# Altium project Carte Oeil.PrjPCB
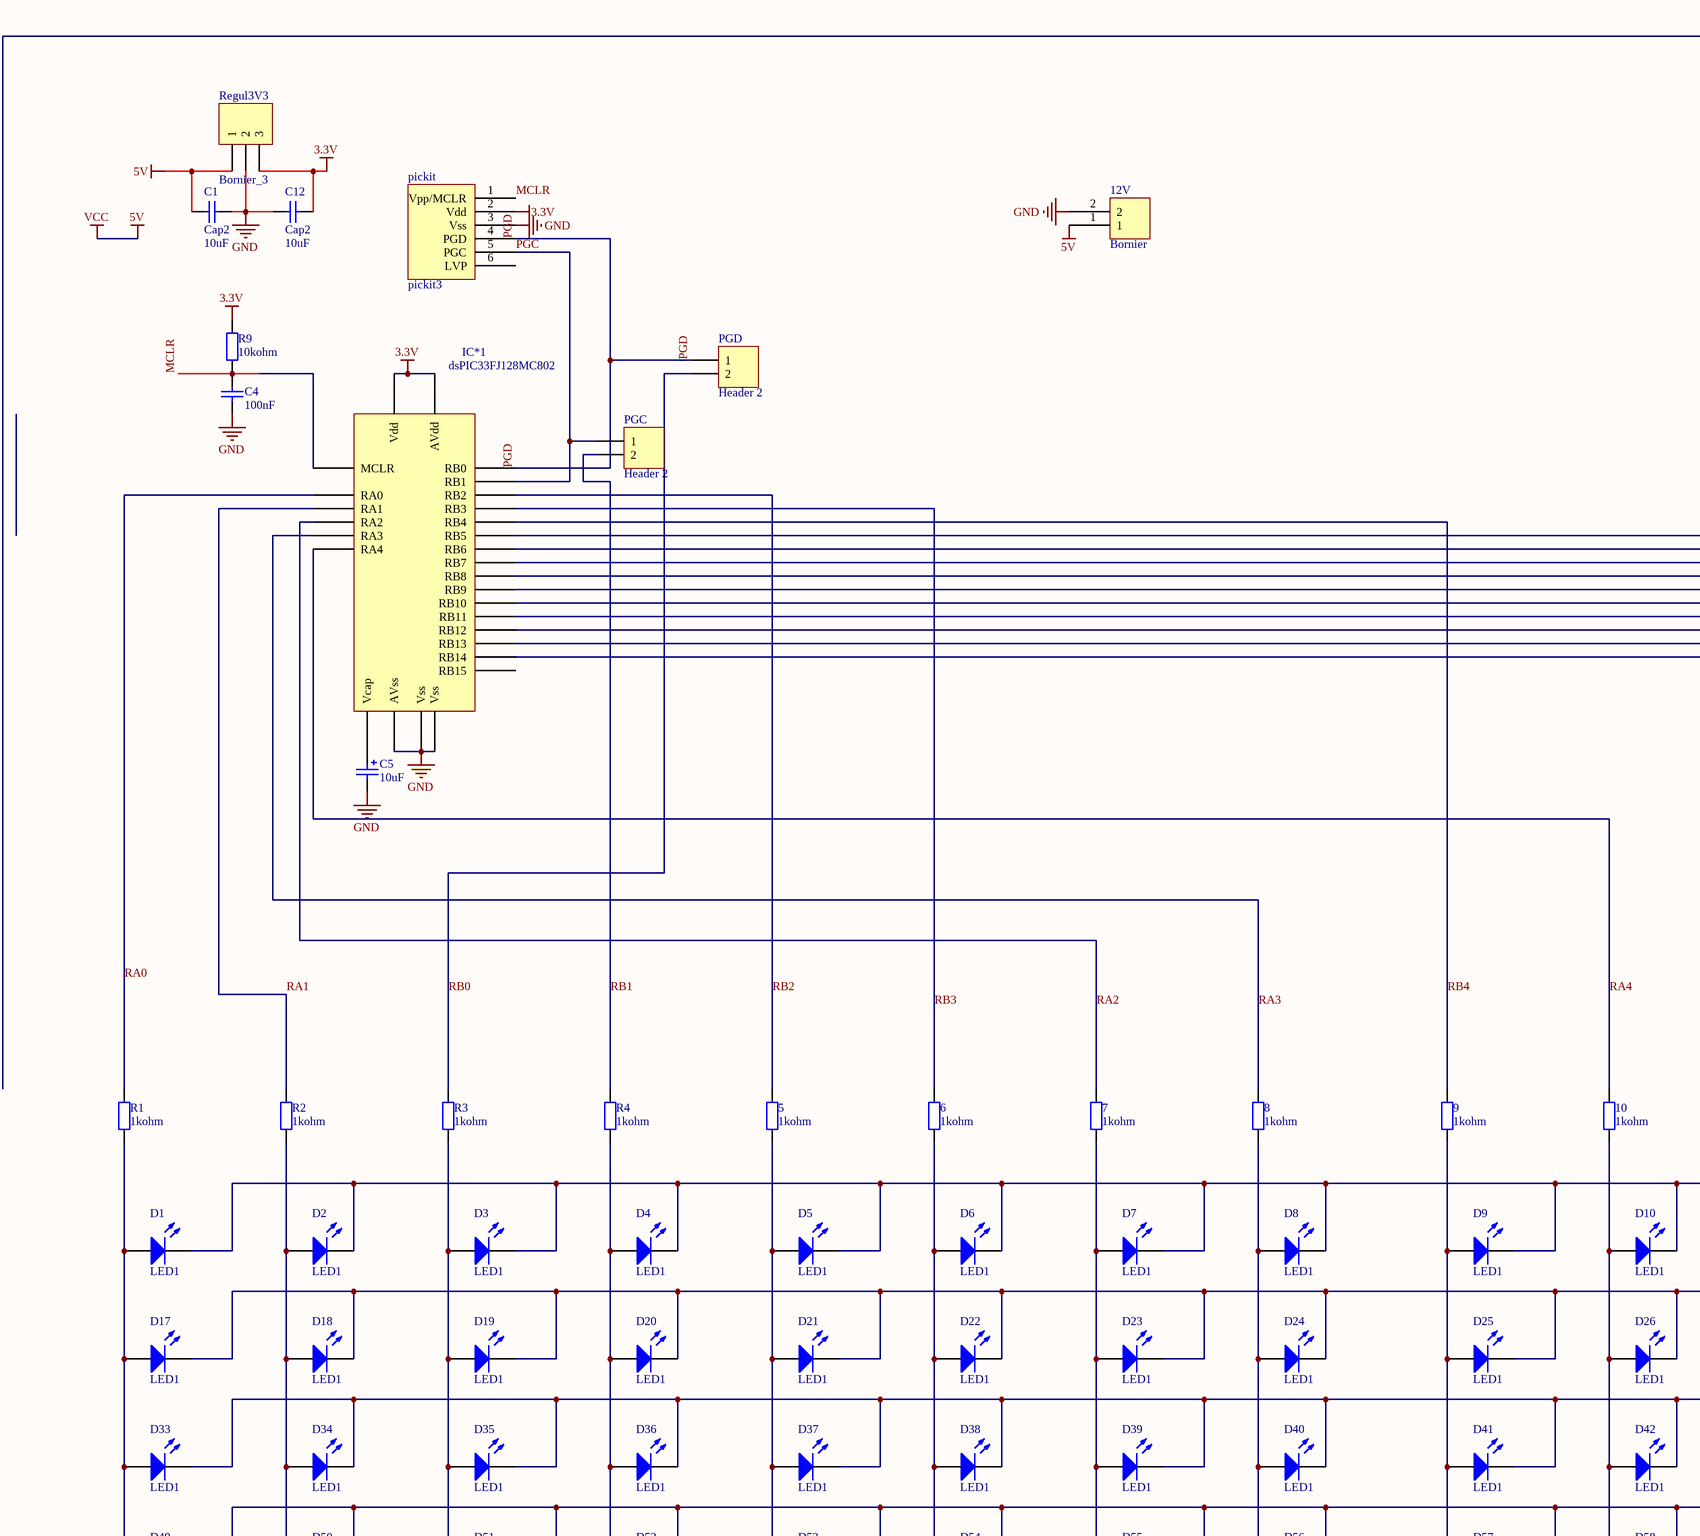
[diagram p0: Carte Oeil.SchDoc, top left]
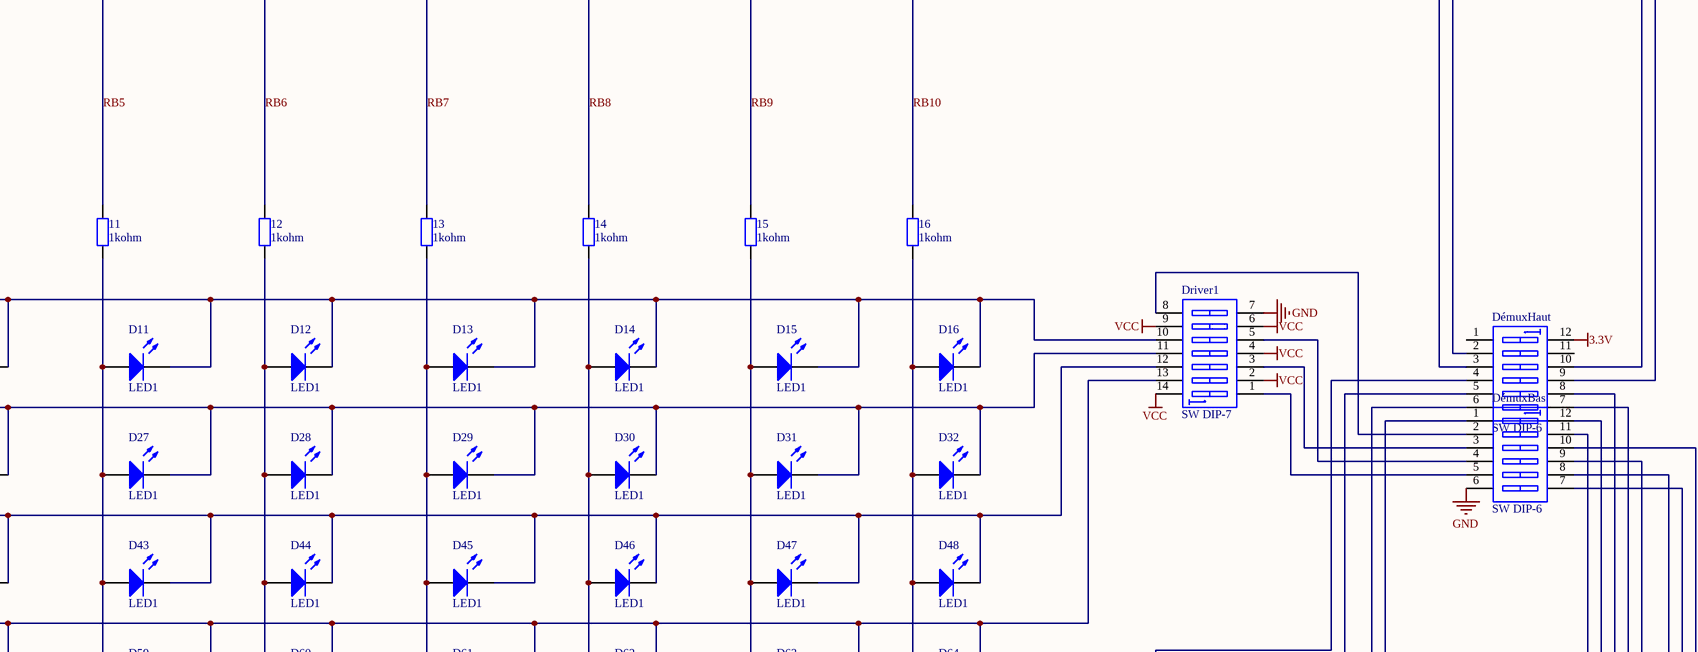
[diagram p1: Carte Oeil.SchDoc, top right]
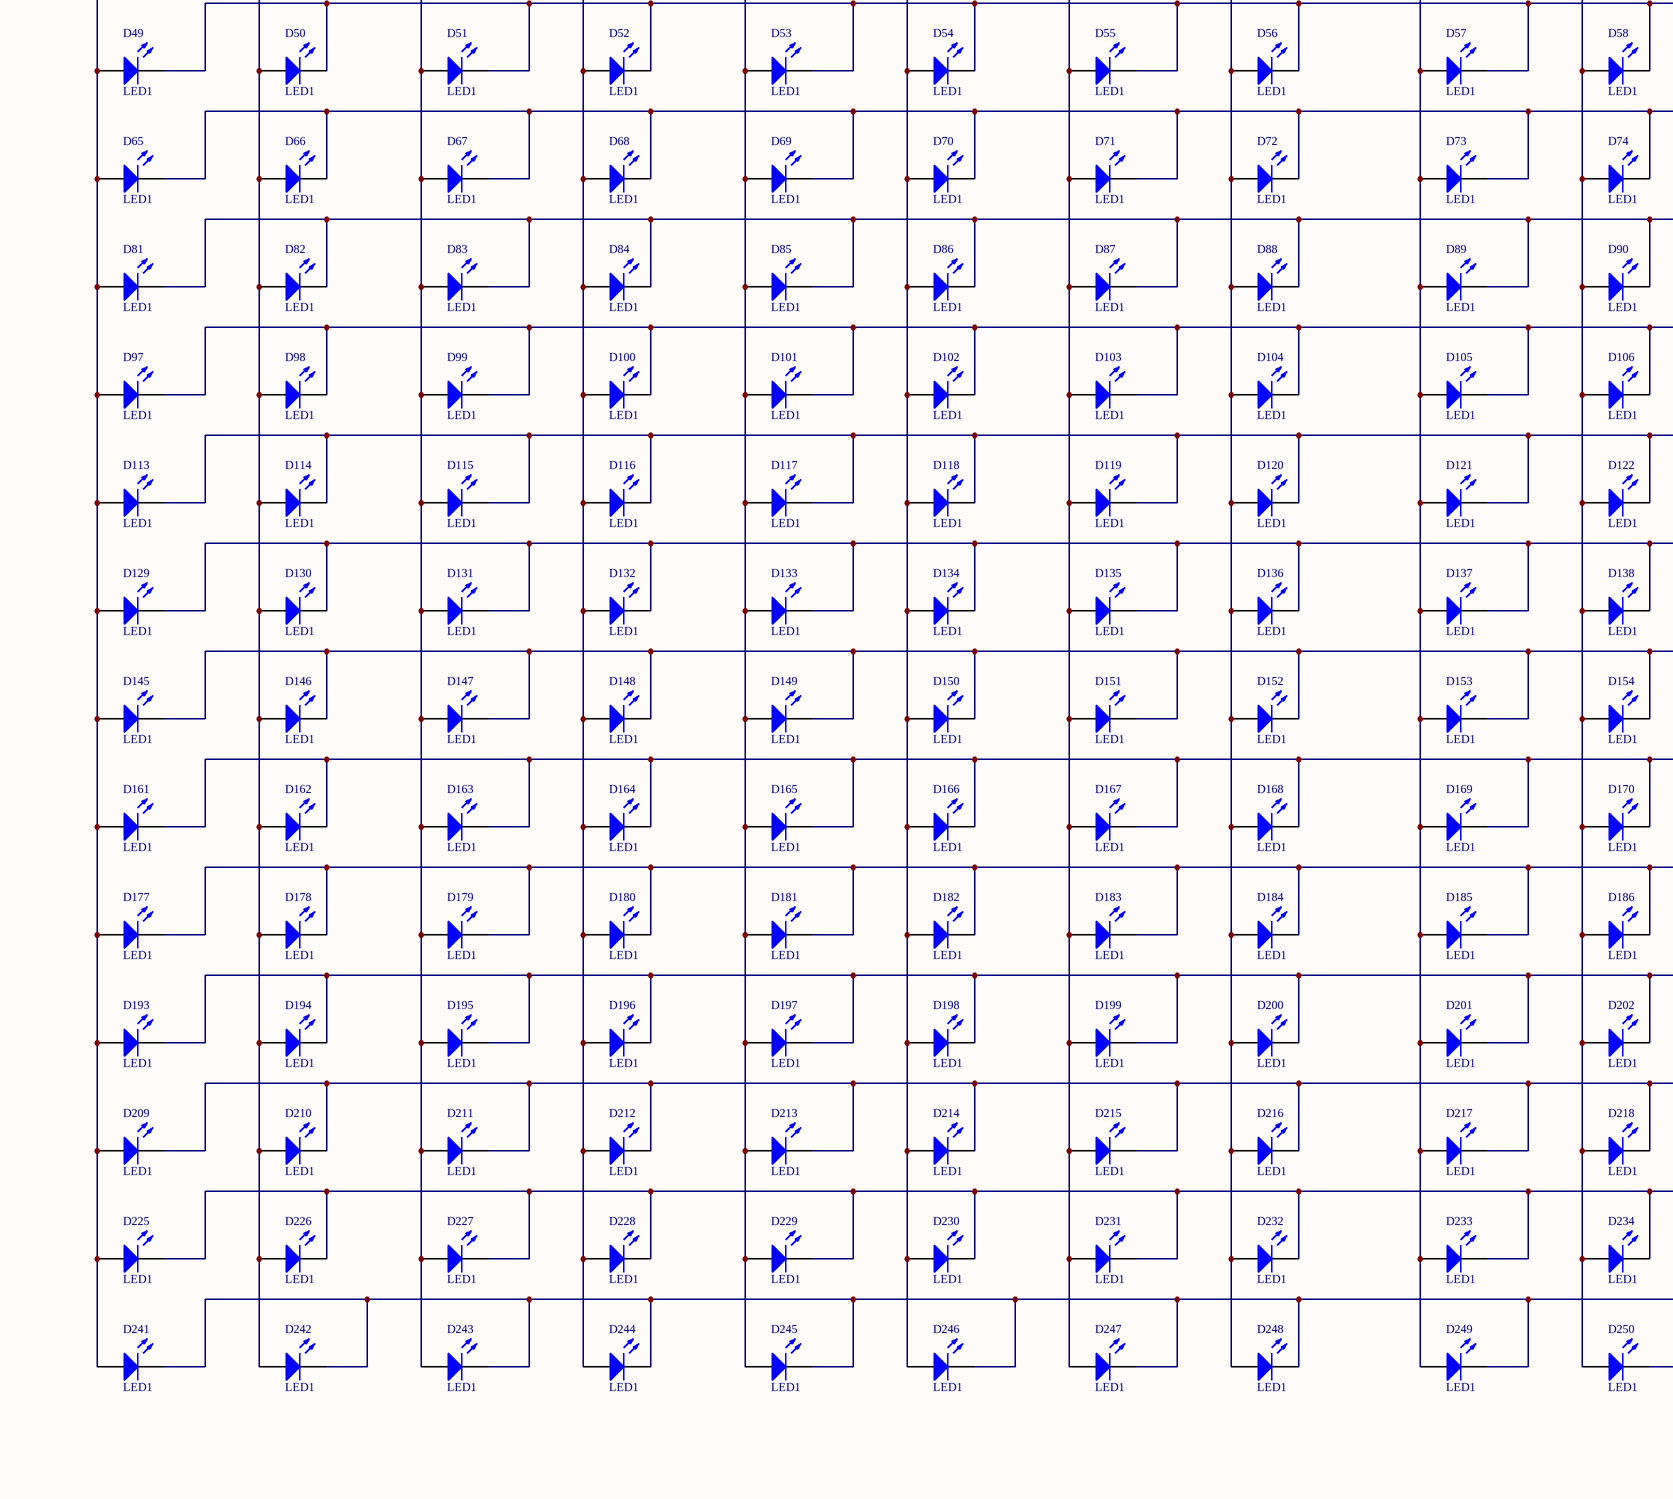
[diagram p2: Carte Oeil.SchDoc, bottom left]
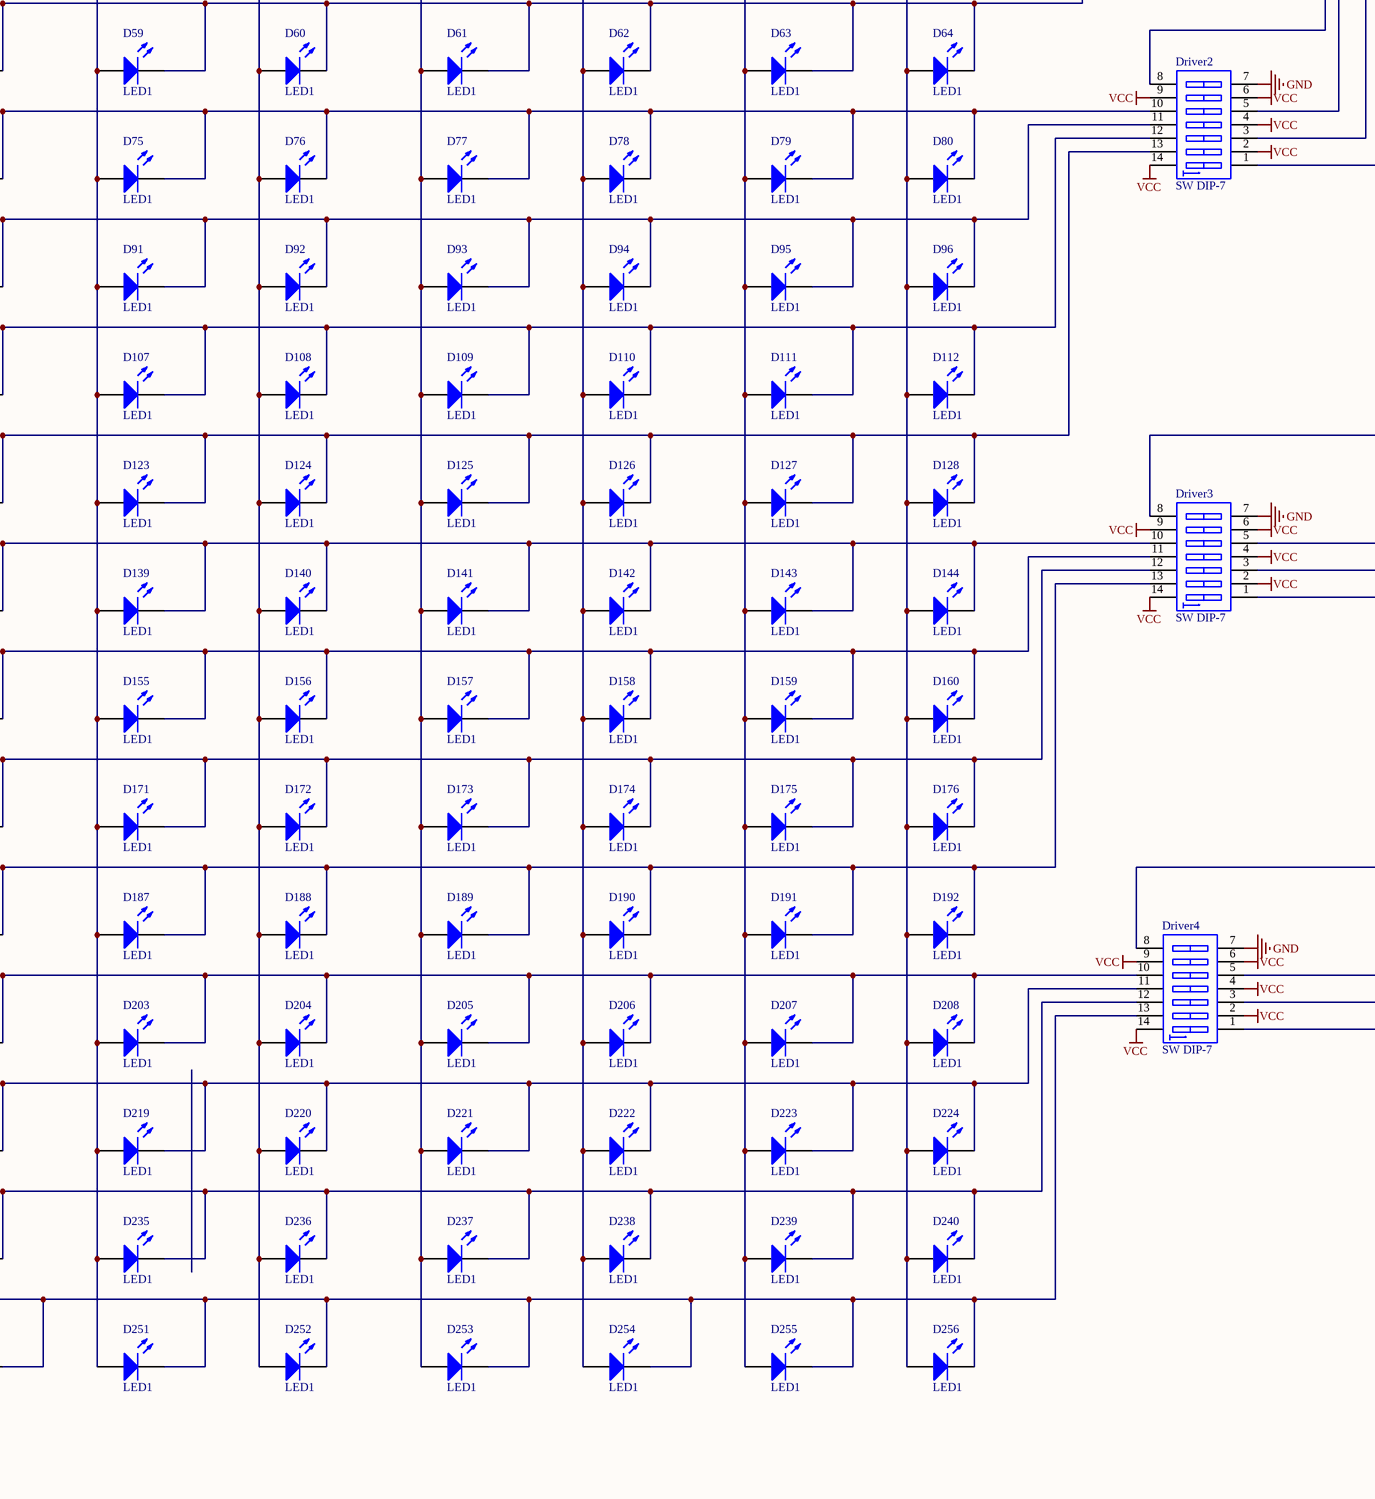
[diagram p3: Carte Oeil.SchDoc, bottom right]
1 sheet, 289 parts. Net scope: global (net labels, ports and power ports of the same name join across sheets).
Board file: Carte Oeil.PcbDoc

## Sheet Carte Oeil.SchDoc
size A1

### Parts
5  1kohm  [AXIAL-0.5]
6  1kohm  [AXIAL-0.5]
7  1kohm  [AXIAL-0.5]
8  1kohm  [AXIAL-0.5]
9  1kohm  [AXIAL-0.5]
10  1kohm  [AXIAL-0.5]
11  1kohm  [AXIAL-0.5]
12  1kohm  [AXIAL-0.5]
12V  Bornier  [Bornier]
13  1kohm  [AXIAL-0.5]
14  1kohm  [AXIAL-0.5]
15  1kohm  [AXIAL-0.5]
16  1kohm  [AXIAL-0.5]
C1  Cap2  value 10uF  [AXIAL-0.5]
C4  100nF  [AXIAL-0.5]
C5  10uF  [AXIAL-0.5]
C12  Cap2  value 10uF  [AXIAL-0.5]
D1  LED1  [LED-1]
D2  LED1  [LED-1]
D3  LED1  [LED-1]
D4  LED1  [LED-1]
D5  LED1  [LED-1]
D6  LED1  [LED-1]
D7  LED1  [LED-1]
D8  LED1  [LED-1]
D9  LED1  [LED-1]
D10  LED1  [LED-1]
D11  LED1  [LED-1]
D12  LED1  [LED-1]
D13  LED1  [LED-1]
D14  LED1  [LED-1]
D15  LED1  [LED-1]
D16  LED1  [LED-1]
D17  LED1  [LED-1]
D18  LED1  [LED-1]
D19  LED1  [LED-1]
D20  LED1  [LED-1]
D21  LED1  [LED-1]
D22  LED1  [LED-1]
D23  LED1  [LED-1]
D24  LED1  [LED-1]
D25  LED1  [LED-1]
D26  LED1  [LED-1]
D27  LED1  [LED-1]
D28  LED1  [LED-1]
D29  LED1  [LED-1]
D30  LED1  [LED-1]
D31  LED1  [LED-1]
D32  LED1  [LED-1]
D33  LED1  [LED-1]
D34  LED1  [LED-1]
D35  LED1  [LED-1]
D36  LED1  [LED-1]
D37  LED1  [LED-1]
D38  LED1  [LED-1]
D39  LED1  [LED-1]
D40  LED1  [LED-1]
D41  LED1  [LED-1]
D42  LED1  [LED-1]
D43  LED1  [LED-1]
D44  LED1  [LED-1]
D45  LED1  [LED-1]
D46  LED1  [LED-1]
D47  LED1  [LED-1]
D48  LED1  [LED-1]
D49  LED1  [LED-1]
D50  LED1  [LED-1]
D51  LED1  [LED-1]
D52  LED1  [LED-1]
D53  LED1  [LED-1]
D54  LED1  [LED-1]
D55  LED1  [LED-1]
D56  LED1  [LED-1]
D57  LED1  [LED-1]
D58  LED1  [LED-1]
D59  LED1  [LED-1]
D60  LED1  [LED-1]
D61  LED1  [LED-1]
D62  LED1  [LED-1]
D63  LED1  [LED-1]
D64  LED1  [LED-1]
D65  LED1  [LED-1]
D66  LED1  [LED-1]
D67  LED1  [LED-1]
D68  LED1  [LED-1]
D69  LED1  [LED-1]
D70  LED1  [LED-1]
D71  LED1  [LED-1]
D72  LED1  [LED-1]
D73  LED1  [LED-1]
D74  LED1  [LED-1]
D75  LED1  [LED-1]
D76  LED1  [LED-1]
D77  LED1  [LED-1]
D78  LED1  [LED-1]
D79  LED1  [LED-1]
D80  LED1  [LED-1]
D81  LED1  [LED-1]
D82  LED1  [LED-1]
D83  LED1  [LED-1]
D84  LED1  [LED-1]
D85  LED1  [LED-1]
D86  LED1  [LED-1]
D87  LED1  [LED-1]
D88  LED1  [LED-1]
D89  LED1  [LED-1]
D90  LED1  [LED-1]
D91  LED1  [LED-1]
D92  LED1  [LED-1]
D93  LED1  [LED-1]
D94  LED1  [LED-1]
D95  LED1  [LED-1]
D96  LED1  [LED-1]
D97  LED1  [LED-1]
D98  LED1  [LED-1]
D99  LED1  [LED-1]
D100  LED1  [LED-1]
D101  LED1  [LED-1]
D102  LED1  [LED-1]
D103  LED1  [LED-1]
D104  LED1  [LED-1]
D105  LED1  [LED-1]
D106  LED1  [LED-1]
D107  LED1  [LED-1]
D108  LED1  [LED-1]
D109  LED1  [LED-1]
D110  LED1  [LED-1]
D111  LED1  [LED-1]
D112  LED1  [LED-1]
D113  LED1  [LED-1]
D114  LED1  [LED-1]
D115  LED1  [LED-1]
D116  LED1  [LED-1]
D117  LED1  [LED-1]
D118  LED1  [LED-1]
D119  LED1  [LED-1]
D120  LED1  [LED-1]
D121  LED1  [LED-1]
D122  LED1  [LED-1]
D123  LED1  [LED-1]
D124  LED1  [LED-1]
D125  LED1  [LED-1]
D126  LED1  [LED-1]
D127  LED1  [LED-1]
D128  LED1  [LED-1]
D129  LED1  [LED-1]
D130  LED1  [LED-1]
D131  LED1  [LED-1]
D132  LED1  [LED-1]
D133  LED1  [LED-1]
D134  LED1  [LED-1]
D135  LED1  [LED-1]
D136  LED1  [LED-1]
D137  LED1  [LED-1]
D138  LED1  [LED-1]
D139  LED1  [LED-1]
D140  LED1  [LED-1]
D141  LED1  [LED-1]
D142  LED1  [LED-1]
D143  LED1  [LED-1]
D144  LED1  [LED-1]
D145  LED1  [LED-1]
D146  LED1  [LED-1]
D147  LED1  [LED-1]
D148  LED1  [LED-1]
D149  LED1  [LED-1]
D150  LED1  [LED-1]
D151  LED1  [LED-1]
D152  LED1  [LED-1]
D153  LED1  [LED-1]
D154  LED1  [LED-1]
D155  LED1  [LED-1]
D156  LED1  [LED-1]
D157  LED1  [LED-1]
D158  LED1  [LED-1]
D159  LED1  [LED-1]
D160  LED1  [LED-1]
D161  LED1  [LED-1]
D162  LED1  [LED-1]
D163  LED1  [LED-1]
D164  LED1  [LED-1]
D165  LED1  [LED-1]
D166  LED1  [LED-1]
D167  LED1  [LED-1]
D168  LED1  [LED-1]
D169  LED1  [LED-1]
D170  LED1  [LED-1]
D171  LED1  [LED-1]
D172  LED1  [LED-1]
D173  LED1  [LED-1]
D174  LED1  [LED-1]
D175  LED1  [LED-1]
D176  LED1  [LED-1]
D177  LED1  [LED-1]
D178  LED1  [LED-1]
D179  LED1  [LED-1]
D180  LED1  [LED-1]
D181  LED1  [LED-1]
D182  LED1  [LED-1]
D183  LED1  [LED-1]
D184  LED1  [LED-1]
D185  LED1  [LED-1]
D186  LED1  [LED-1]
D187  LED1  [LED-1]
D188  LED1  [LED-1]
D189  LED1  [LED-1]
D190  LED1  [LED-1]
D191  LED1  [LED-1]
D192  LED1  [LED-1]
D193  LED1  [LED-1]
D194  LED1  [LED-1]
D195  LED1  [LED-1]
D196  LED1  [LED-1]
D197  LED1  [LED-1]
D198  LED1  [LED-1]
D199  LED1  [LED-1]
D200  LED1  [LED-1]
D201  LED1  [LED-1]
D202  LED1  [LED-1]
D203  LED1  [LED-1]
D204  LED1  [LED-1]
D205  LED1  [LED-1]
D206  LED1  [LED-1]
D207  LED1  [LED-1]
D208  LED1  [LED-1]
D209  LED1  [LED-1]
D210  LED1  [LED-1]
D211  LED1  [LED-1]
D212  LED1  [LED-1]
D213  LED1  [LED-1]
D214  LED1  [LED-1]
D215  LED1  [LED-1]
D216  LED1  [LED-1]
D217  LED1  [LED-1]
D218  LED1  [LED-1]
D219  LED1  [LED-1]
D220  LED1  [LED-1]
D221  LED1  [LED-1]
D222  LED1  [LED-1]
D223  LED1  [LED-1]
D224  LED1  [LED-1]
D225  LED1  [LED-1]
D226  LED1  [LED-1]
D227  LED1  [LED-1]
D228  LED1  [LED-1]
D229  LED1  [LED-1]
D230  LED1  [LED-1]
D231  LED1  [LED-1]
D232  LED1  [LED-1]
D233  LED1  [LED-1]
D234  LED1  [LED-1]
D235  LED1  [LED-1]
D236  LED1  [LED-1]
D237  LED1  [LED-1]
D238  LED1  [LED-1]
D239  LED1  [LED-1]
D240  LED1  [LED-1]
D241  LED1  [LED-1]
D242  LED1  [LED-1]
D243  LED1  [LED-1]
D244  LED1  [LED-1]
D245  LED1  [LED-1]
D246  LED1  [LED-1]
D247  LED1  [LED-1]
D248  LED1  [LED-1]
D249  LED1  [LED-1]
D250  LED1  [LED-1]
D251  LED1  [LED-1]
D252  LED1  [LED-1]
D253  LED1  [LED-1]
D254  LED1  [LED-1]
D255  LED1  [LED-1]
D256  LED1  [LED-1]
Driver1  SW DIP-7  [DIP-14]
Driver2  SW DIP-7  [DIP-14]
Driver3  SW DIP-7  [DIP-14]
Driver4  SW DIP-7  [DIP-14]
DémuxBas  SW DIP-6  [DIP-12/SW]
DémuxHaut  SW DIP-6  [DIP-12/SW]
IC*1  dsPIC33FJ128MC802  [SPDIP300-SP28]
PGC  Header 2  [HDR1X2]
PGD  Header 2  [HDR1X2]
pickit  pickit3  [HDR1X5]
R1  1kohm  [AXIAL-0.5]
R2  1kohm  [AXIAL-0.5]
R3  1kohm  [AXIAL-0.5]
R4  1kohm  [AXIAL-0.5]
R9  10kohm  [AXIAL-0.5]
Regul3V3  Bornier_3  [D2PAK_N]

### Nets
3.3V: C12.2 DémuxHaut.12(B1) IC*1.13(Vdd) IC*1.28(AVdd) pickit.2(Vdd) R9.2 Regul3V3.3
5V: 12V.1 C1.1 Driver1.2(A2) Driver1.4(A4) Driver1.6(A6) Driver1.9(B6) Driver1.14(B1) Driver2.2(A2) Driver2.4(A4) Driver2.6(A6) Driver2.9(B6) Driver2.14(B1) Driver3.2(A2) Driver3.4(A4) Driver3.6(A6) Driver3.9(B6) Driver3.14(B1) Driver4.2(A2) Driver4.4(A4) Driver4.6(A6) Driver4.9(B6) Driver4.14(B1) Regul3V3.1  [also labelled VCC]
GND: 12V.2 C1.2 C4.1 C5.2 C12.1 Driver1.7(A7) Driver2.7(A7) Driver3.7(A7) Driver4.7(A7) DémuxBas.6(A6) IC*1.8(Vss) IC*1.19(Vss) IC*1.27(AVss) pickit.3(Vss) Regul3V3.2
MCLR: C4.2 IC*1.1(MCLR) pickit.1(Vpp/MCLR) R9.1
PGC: IC*1.5(RB1) PGC.1 pickit.5(PGC)
PGD: IC*1.4(RB0) PGD.1 pickit.4(PGD)
RA0: IC*1.2(RA0) R1.2
RA1: IC*1.3(RA1) R2.2
RA2: 7.2 IC*1.9(RA2)
RA3: 8.2 IC*1.10(RA3)
RA4: 10.2 IC*1.12(RA4)
RB0: PGD.2 R3.2
RB1: PGC.2 R4.2
RB2: 5.2 IC*1.6(RB2)
RB3: 6.2 IC*1.7(RB3)
RB4: 9.2 IC*1.11(RB4)
RB5: 11.2 IC*1.14(RB5)
RB6: 12.2 IC*1.15(RB6)
RB7: 13.2 IC*1.16(RB7)
RB8: 14.2 IC*1.17(RB8)
RB9: 15.2 IC*1.18(RB9)
RB10: 16.2 IC*1.21(RB10)
Net5_1: 5.1 D5.1(A) D21.1(A) D37.1(A) D53.1(A) D69.1(A) D85.1(A) D101.1(A) D117.1(A) D133.1(A) D149.1(A) D165.1(A) D181.1(A) D197.1(A) D213.1(A) D229.1(A) D245.1(A)
Net6_1: 6.1 D6.1(A) D22.1(A) D38.1(A) D54.1(A) D70.1(A) D86.1(A) D102.1(A) D118.1(A) D134.1(A) D150.1(A) D166.1(A) D182.1(A) D198.1(A) D214.1(A) D230.1(A) D246.1(A)
Net7_1: 7.1 D7.1(A) D23.1(A) D39.1(A) D55.1(A) D71.1(A) D87.1(A) D103.1(A) D119.1(A) D135.1(A) D151.1(A) D167.1(A) D183.1(A) D199.1(A) D215.1(A) D231.1(A) D247.1(A)
Net8_1: 8.1 D8.1(A) D24.1(A) D40.1(A) D56.1(A) D72.1(A) D88.1(A) D104.1(A) D120.1(A) D136.1(A) D152.1(A) D168.1(A) D184.1(A) D200.1(A) D216.1(A) D232.1(A) D248.1(A)
Net9_1: 9.1 D9.1(A) D25.1(A) D41.1(A) D57.1(A) D73.1(A) D89.1(A) D105.1(A) D121.1(A) D137.1(A) D153.1(A) D169.1(A) D185.1(A) D201.1(A) D217.1(A) D233.1(A) D249.1(A)
Net10_1: 10.1 D10.1(A) D26.1(A) D42.1(A) D58.1(A) D74.1(A) D90.1(A) D106.1(A) D122.1(A) D138.1(A) D154.1(A) D170.1(A) D186.1(A) D202.1(A) D218.1(A) D234.1(A) D250.1(A)
Net11_1: 11.1 D11.1(A) D27.1(A) D43.1(A) D59.1(A) D75.1(A) D91.1(A) D107.1(A) D123.1(A) D139.1(A) D155.1(A) D171.1(A) D187.1(A) D203.1(A) D219.1(A) D235.1(A) D251.1(A)
Net12_1: 12.1 D12.1(A) D28.1(A) D44.1(A) D60.1(A) D76.1(A) D92.1(A) D108.1(A) D124.1(A) D140.1(A) D156.1(A) D172.1(A) D188.1(A) D204.1(A) D220.1(A) D236.1(A) D252.1(A)
Net13_1: 13.1 D13.1(A) D29.1(A) D45.1(A) D61.1(A) D77.1(A) D93.1(A) D109.1(A) D125.1(A) D141.1(A) D157.1(A) D173.1(A) D189.1(A) D205.1(A) D221.1(A) D237.1(A) D253.1(A)
Net14_1: 14.1 D14.1(A) D30.1(A) D46.1(A) D62.1(A) D78.1(A) D94.1(A) D110.1(A) D126.1(A) D142.1(A) D158.1(A) D174.1(A) D190.1(A) D206.1(A) D222.1(A) D238.1(A) D254.1(A)
Net15_1: 15.1 D15.1(A) D31.1(A) D47.1(A) D63.1(A) D79.1(A) D95.1(A) D111.1(A) D127.1(A) D143.1(A) D159.1(A) D175.1(A) D191.1(A) D207.1(A) D223.1(A) D239.1(A) D255.1(A)
Net16_1: 16.1 D16.1(A) D32.1(A) D48.1(A) D64.1(A) D80.1(A) D96.1(A) D112.1(A) D128.1(A) D144.1(A) D160.1(A) D176.1(A) D192.1(A) D208.1(A) D224.1(A) D240.1(A) D256.1(A)
NetC5_1: C5.1 IC*1.20(Vcap)
NetD1_1: D1.1(A) D17.1(A) D33.1(A) D49.1(A) D65.1(A) D81.1(A) D97.1(A) D113.1(A) D129.1(A) D145.1(A) D161.1(A) D177.1(A) D193.1(A) D209.1(A) D225.1(A) D241.1(A) R1.1
NetD1_2: D1.2(K) D2.2(K) D3.2(K) D4.2(K) D5.2(K) D6.2(K) D7.2(K) D8.2(K) D9.2(K) D10.2(K) D11.2(K) D12.2(K) D13.2(K) D14.2(K) D15.2(K) D16.2(K) Driver1.10(B5)
NetD2_1: D2.1(A) D18.1(A) D34.1(A) D50.1(A) D66.1(A) D82.1(A) D98.1(A) D114.1(A) D130.1(A) D146.1(A) D162.1(A) D178.1(A) D194.1(A) D210.1(A) D226.1(A) D242.1(A) R2.1
NetD3_1: D3.1(A) D19.1(A) D35.1(A) D51.1(A) D67.1(A) D83.1(A) D99.1(A) D115.1(A) D131.1(A) D147.1(A) D163.1(A) D179.1(A) D195.1(A) D211.1(A) D227.1(A) D243.1(A) R3.1
NetD4_1: D4.1(A) D20.1(A) D36.1(A) D52.1(A) D68.1(A) D84.1(A) D100.1(A) D116.1(A) D132.1(A) D148.1(A) D164.1(A) D180.1(A) D196.1(A) D212.1(A) D228.1(A) D244.1(A) R4.1
NetD17_2: D17.2(K) D18.2(K) D19.2(K) D20.2(K) D21.2(K) D22.2(K) D23.2(K) D24.2(K) D25.2(K) D26.2(K) D27.2(K) D28.2(K) D29.2(K) D30.2(K) D31.2(K) D32.2(K) Driver1.11(B4)
NetD33_2: D33.2(K) D34.2(K) D35.2(K) D36.2(K) D37.2(K) D38.2(K) D39.2(K) D40.2(K) D41.2(K) D42.2(K) D43.2(K) D44.2(K) D45.2(K) D46.2(K) D47.2(K) D48.2(K) Driver1.12(B3)
NetD49_2: D49.2(K) D50.2(K) D51.2(K) D52.2(K) D53.2(K) D54.2(K) D55.2(K) D56.2(K) D57.2(K) D58.2(K) D59.2(K) D60.2(K) D61.2(K) D62.2(K) D63.2(K) D64.2(K) Driver1.13(B2)
NetD65_2: D65.2(K) D66.2(K) D67.2(K) D68.2(K) D69.2(K) D70.2(K) D71.2(K) D72.2(K) D73.2(K) D74.2(K) D75.2(K) D76.2(K) D77.2(K) D78.2(K) D79.2(K) D80.2(K) Driver2.10(B5)
NetD81_2: D81.2(K) D82.2(K) D83.2(K) D84.2(K) D85.2(K) D86.2(K) D87.2(K) D88.2(K) D89.2(K) D90.2(K) D91.2(K) D92.2(K) D93.2(K) D94.2(K) D95.2(K) D96.2(K) Driver2.11(B4)
NetD97_2: D97.2(K) D98.2(K) D99.2(K) D100.2(K) D101.2(K) D102.2(K) D103.2(K) D104.2(K) D105.2(K) D106.2(K) D107.2(K) D108.2(K) D109.2(K) D110.2(K) D111.2(K) D112.2(K) Driver2.12(B3)
NetD113_2: D113.2(K) D114.2(K) D115.2(K) D116.2(K) D117.2(K) D118.2(K) D119.2(K) D120.2(K) D121.2(K) D122.2(K) D123.2(K) D124.2(K) D125.2(K) D126.2(K) D127.2(K) D128.2(K) Driver2.13(B2)
NetD129_2: D129.2(K) D130.2(K) D131.2(K) D132.2(K) D133.2(K) D134.2(K) D135.2(K) D136.2(K) D137.2(K) D138.2(K) D139.2(K) D140.2(K) D141.2(K) D142.2(K) D143.2(K) D144.2(K) Driver3.10(B5)
NetD145_2: D145.2(K) D146.2(K) D147.2(K) D148.2(K) D149.2(K) D150.2(K) D151.2(K) D152.2(K) D153.2(K) D154.2(K) D155.2(K) D156.2(K) D157.2(K) D158.2(K) D159.2(K) D160.2(K) Driver3.11(B4)
NetD161_2: D161.2(K) D162.2(K) D163.2(K) D164.2(K) D165.2(K) D166.2(K) D167.2(K) D168.2(K) D169.2(K) D170.2(K) D171.2(K) D172.2(K) D173.2(K) D174.2(K) D175.2(K) D176.2(K) Driver3.12(B3)
NetD177_2: D177.2(K) D178.2(K) D179.2(K) D180.2(K) D181.2(K) D182.2(K) D183.2(K) D184.2(K) D185.2(K) D186.2(K) D187.2(K) D188.2(K) D189.2(K) D190.2(K) D191.2(K) D192.2(K) Driver3.13(B2)
NetD193_2: D193.2(K) D194.2(K) D195.2(K) D196.2(K) D197.2(K) D198.2(K) D199.2(K) D200.2(K) D201.2(K) D202.2(K) D203.2(K) D204.2(K) D205.2(K) D206.2(K) D207.2(K) D208.2(K) Driver4.10(B5)
NetD209_2: D209.2(K) D210.2(K) D211.2(K) D212.2(K) D213.2(K) D214.2(K) D215.2(K) D216.2(K) D217.2(K) D218.2(K) D219.2(K) D220.2(K) D221.2(K) D222.2(K) D223.2(K) D224.2(K) Driver4.11(B4)
NetD225_2: D225.2(K) D226.2(K) D227.2(K) D228.2(K) D229.2(K) D230.2(K) D231.2(K) D232.2(K) D233.2(K) D234.2(K) D235.2(K) D236.2(K) D237.2(K) D238.2(K) D239.2(K) D240.2(K) Driver4.12(B3)
NetD241_2: D241.2(K) D242.2(K) D243.2(K) D244.2(K) D245.2(K) D246.2(K) D247.2(K) D248.2(K) D249.2(K) D250.2(K) D251.2(K) D252.2(K) D253.2(K) D254.2(K) D255.2(K) D256.2(K) Driver4.13(B2)
NetDriver1_1: Driver1.1(A1) DémuxBas.5(A5)
NetDriver1_3: Driver1.3(A3) DémuxBas.3(A3)
NetDriver1_5: Driver1.5(A5) DémuxBas.4(A4)
NetDriver1_8: Driver1.8(B7) DémuxBas.2(A2)
NetDriver2_1: Driver2.1(A1) DémuxBas.1(A1)
NetDriver2_3: Driver2.3(A3) DémuxHaut.6(A6)
NetDriver2_5: Driver2.5(A5) DémuxHaut.5(A5)
NetDriver2_8: Driver2.8(B7) DémuxHaut.4(A4)
NetDriver3_1: Driver3.1(A1) DémuxBas.11(B2)
NetDriver3_3: Driver3.3(A3) DémuxBas.12(B1)
NetDriver3_5: Driver3.5(A5) DémuxHaut.8(B5)
NetDriver3_8: Driver3.8(B7) DémuxHaut.7(B6)
NetDriver4_1: Driver4.1(A1) DémuxBas.8(B5)
NetDriver4_3: Driver4.3(A3) DémuxBas.7(B6)
NetDriver4_5: Driver4.5(A5) DémuxBas.9(B4)
NetDriver4_8: Driver4.8(B7) DémuxBas.10(B3)
NetDémuxHaut_2: DémuxHaut.2(A2) IC*1.22(RB11)
NetDémuxHaut_3: DémuxHaut.3(A3) IC*1.23(RB12)
NetDémuxHaut_9: DémuxHaut.9(B4) IC*1.25(RB14)
NetDémuxHaut_10: DémuxHaut.10(B3) IC*1.24(RB13)

Not connected (* = marked no-connect by the designer): DémuxHaut 1(A1) 11(B2); IC*1 26(RB15); pickit 6(LVP)

### Library data of the parts
5-16 R1-R4 R9 = Resistance
12V = Bornier2
C1 C12 = Cap2: Capacitor; Published: 8-Jun-2000; LatestRevisionDate: 17-Jul-2002; LatestRevisionNote: Re-released for DXP Platform.; PackageReference: RAD-0.3; Publisher: Altium Limited
C4 = Capa
C5 = Capa Pol
D1-D256 = LED1: Typical RED GaAs LED; Published: 8-Jun-2000; LatestRevisionDate: 08-Jul-2005; LatestRevisionNote: Mech Layer 1 removed.; PackageReference: LED-1; Publisher: Altium Limited; PackageDescription: LED; 2 Leads
Driver1-Driver4 = SW DIP-7: DIP Switch, 7 Position, SPST; Published: 24-Mar-1999; LatestRevisionDate: 17-Jul-2002; LatestRevisionNote: Re-released for DXP Platform.; PackageReference: DIP-14; Publisher: Altium Limited; Code_JEDEC: MO-001-AF
DémuxBas DémuxHaut = SW DIP-6: DIP Switch, 6 Position, SPST; Published: 24-Mar-1999; LatestRevisionDate: 17-Jul-2002; LatestRevisionNote: Re-released for DXP Platform.; PackageReference: DIP-12/SW; Publisher: Altium Limited; PackageDescription: DIP Switch; 12 Leads
PGC PGD = Header 2: Header, 2-Pin; LatestRevisionDate: 17-Jul-2002; LatestRevisionNote: Re-released for DXP Platform.; Publisher: Altium Limited
Regul3V3 = Bornier_3: Header, 3-Pin; LatestRevisionDate: 17-Jul-2002; LatestRevisionNote: Re-released for DXP Platform.; Publisher: Altium Limited